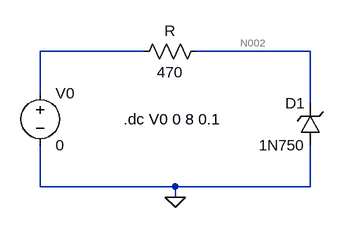
[diagram p0: schematic 5.asc]
5.asc, the LTspice schematic file:
Version 4
SHEET 1 880 680
WIRE 112 -112 -48 -112
WIRE 368 -112 192 -112
WIRE -48 -48 -48 -112
WIRE 368 -32 368 -112
WIRE -48 96 -48 32
WIRE 160 96 -48 96
WIRE 368 96 368 32
WIRE 368 96 160 96
WIRE 160 112 160 96
FLAG 160 112 0
SYMBOL res 208 -128 R90
WINDOW 0 0 56 VBottom 2
WINDOW 3 32 56 VTop 2
SYMATTR InstName R
SYMATTR Value 470
SYMBOL voltage -48 -64 R0
WINDOW 123 0 0 Left 0
WINDOW 39 0 0 Left 0
SYMATTR InstName V0
SYMATTR Value 0
SYMBOL zener 384 32 R180
WINDOW 0 24 64 Left 2
WINDOW 3 24 0 Left 2
SYMATTR InstName D1
SYMATTR Value 1N750
SYMATTR Description Diode
SYMATTR Type diode
TEXT 80 -8 Left 2 !.dc V0 0 8 0.1

The netlist it stands for:
* 5.asc
R N002 N001 470
V0 N001 0 0
D1 0 N002 1N750
.model D D
.lib standard.dio
.dc V0 0 8 0.1
.backanno
.end

* Results of the author's LTspice run, read from the files saved beside the schematic
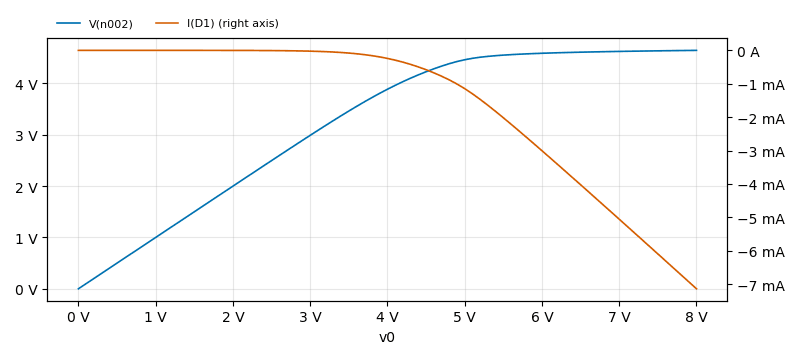
[diagram p1: DC transfer characteristic of 5.asc, plotted from the saved traces]
* DC transfer characteristic, 1 run:
*   V(n002): 0 V at v0=0 V, 4.644 V at v0=8 V, min 0 V, max 4.644 V
*   I(D1): 0 A at v0=0 V, -7.14 mA at v0=8 V, min -7.14 mA, max 0 A